# Altium schematic sheet MMC_2_4_Ethernet.SchDoc
size A4
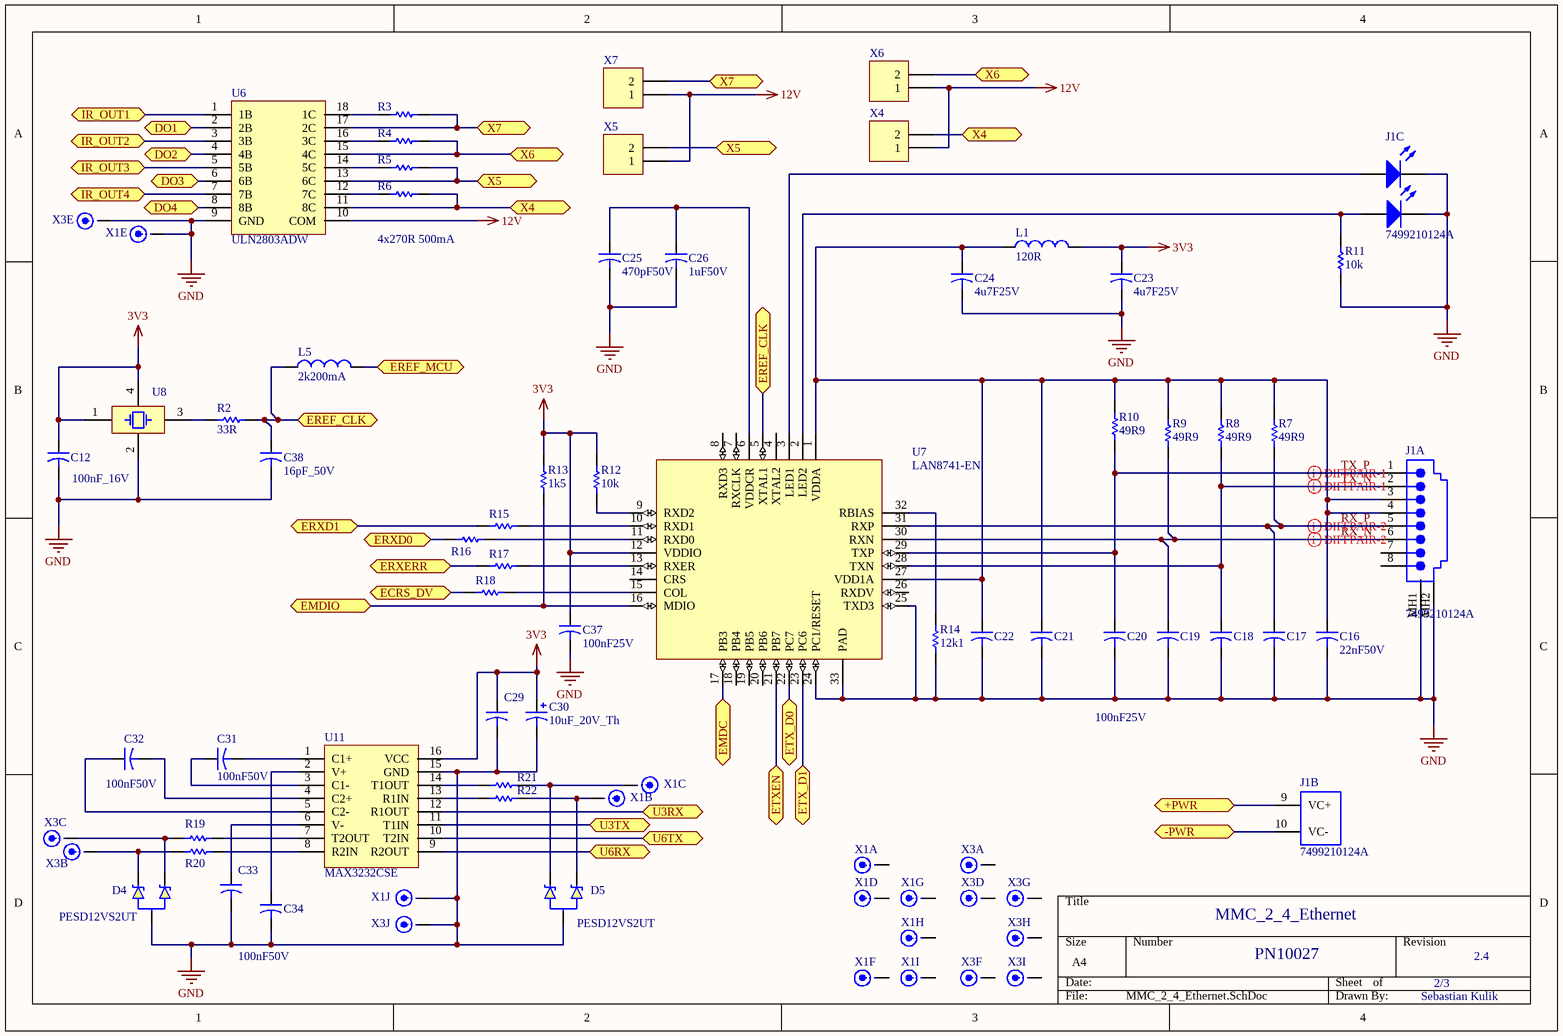
[diagram p0: MMC_2_4_Ethernet.SchDoc]

## Parts
C12  value 100nF_16V  [C0402]  (hidden comment: 100nF16V_0402)
C16  value 22nF50V  [C0603]  (hidden comment: 22nF50V_0603)
C17  10pF50V_0603  [C0603]  (value not drawn)
C18  10pF50V_0603  [C0603]  (value not drawn)
C19  10pF50V_0603  [C0603]  (value not drawn)
C20  10pF50V_0603  [C0603]  (value not drawn)
C21  value 100nF25V  [C0402]  (hidden comment: 100nF25V_0402)
C22  100nF25V_0402  [C0402]  (value not drawn)
C23  value 4u7F25V  [C0805]  (hidden comment: 4u7F25V_0805)
C24  value 4u7F25V  [C0805]  (hidden comment: 4u7F25V_0805)
C25  value 470pF50V  [C0402]  (hidden comment: 470pF50V_0402)
C26  value 1uF50V  [C0603]  (hidden comment: 1uF50V_0603)
C29  100nF25V_0402  [C0402]  (value not drawn)
C30  value 10uF_20V_Th  [Vishay293D-B]  (hidden comment: 10uF_20V_V293D-B)
C31  value 100nF50V  [C0402]  (hidden comment: 100n50V_0402)
C32  value 100nF50V  [C0402]  (hidden comment: 100n50V_0402)
C33  100n50V_0402  [C0402]  (value not drawn)
C34  value 100nF50V  [C0402]  (hidden comment: 100n50V_0402)
C37  value 100nF25V  [C0402]  (hidden comment: 100nF25V_0402)
C38  value 16pF_50V  [C0402]  (hidden comment: 16pF50V_0402)
D4  PESD12VS2UT  [SOT23_N]
D5  PESD12VS2UT  [SOT23_N]
J1  7499210124A  [7499210124A]  (parts A,B,C of 3)
L1  value 120R  [L0603]  (hidden comment: 120R4A_0603)
L5  value 2k200mA  [L0805_M]  (hidden comment: 2k200mA_0805)
R2  value 33R  [R0402]  (hidden comment: 33R_0402)
R3  270R_1210  [R1210_N]  (value not drawn)
R4  270R_1210  [R1210_N]  (value not drawn)
R5  270R_1210  [R1210_N]  (value not drawn)
R6  270R_1210  [R1210_N]  (value not drawn)
R7  value 49R9  [R0402]  (hidden comment: 49R9_0402)
R8  value 49R9  [R0402]  (hidden comment: 49R9_0402)
R9  value 49R9  [R0402]  (hidden comment: 49R9_0402)
R10  value 49R9  [R0402]  (hidden comment: 49R9_0402)
R11  value 10k  [R0402]  (hidden comment: 10k_0402)
R12  value 10k  [R0402]  (hidden comment: 10k_0402)
R13  value 1k5  [R0402]  (hidden comment: 1k5_0402)
R14  value 12k1  [R0603(1608)]  (hidden comment: 12k1_0603)
R15  10R_0402  [R0402]  (value not drawn)
R16  10R_0402  [R0402]  (value not drawn)
R17  10R_0402  [R0402]  (value not drawn)
R18  10R_0402  [R0402]  (value not drawn)
R19  10R_0402  [R0402]  (value not drawn)
R20  10R_0402  [R0402]  (value not drawn)
R21  10R_0402  [R0402]  (value not drawn)
R22  10R_0402  [R0402]  (value not drawn)
U6  ULN2803ADW  [SOIC18-WIDE]
U7  LAN8741-EN  [32M1-A_M]
U8  SG - 211 S*E -50.000M  [SG - 211 S*E]  (value not drawn)
U11  MAX3232CSE  [SOIC16_L]
X1  SUB-D_9  [M09HP]  (value not drawn)  (parts A,B,C,D,E,F,G,H,I,J of 10)
X3  SUB-D_9  [M09HP]  (value not drawn)  (parts A,B,C,D,E,F,G,H,I,J of 10)
X4  WR-TBL3127  [WR-TBL-3127]  (value not drawn)
X5  WR-TBL3127  [WR-TBL-3127]  (value not drawn)
X6  WR-TBL3127  [WR-TBL-3127]  (value not drawn)
X7  WR-TBL3127  [WR-TBL-3127]  (value not drawn)

## Ports
+PWR, -PWR, DO1, DO2, DO3, DO4, ECRS_DV, EMDC, EMDIO, EREF_CLK, EREF_MCU, ERXD0, ERXD1, ERXERR, ETX_D0, ETX_D1, ETXEN, IR_OUT1, IR_OUT2, IR_OUT3, IR_OUT4, U3RX, U3TX, U6RX, U6TX, X4, X5, X6, X7

## Nets
3V3: C12.1 C23.1 C29.1 C30.1 C37.1 L1.2 R12.2 R13.2 U7.12(VDDIO) U8.1(E/D) U8.4(VCC) U11.16(VCC)
12V: U6.10(COM) X4.1 X5.1 X6.1 X7.1
GND: C12.2 C16.2 C17.2 C18.2 C19.2 C20.2 C21.2 C22.2 C23.2 C24.2 C25.2 C26.2 C29.2 C30.2 C33.2 C34.2 C37.2 C38.2 D4.1(A) D5.1(A) J1.11(K) J1.13(K) J1.MH1(Shield) J1.MH2(Shield) R11.1 R14.1 U6.9(GND) U7.24(PC1/RESET) U7.25(TXD3) U7.33(PAD) U8.2(GND) U11.15(GND) X1.5 X1.10(GND) X3.5 X3.10(GND)
+PWR: J1.9(VC+) ; port +PWR
-PWR: J1.10(VC-) ; port -PWR
DO1: U6.2(2B) ; port DO1
DO2: U6.4(4B) ; port DO2
DO3: U6.6(6B) ; port DO3
DO4: U6.8(8B) ; port DO4
ECRS_DV: R18.2 ; port ECRS_DV
EMDC: U7.17(PB3) ; port EMDC
EMDIO: R13.1 U7.16(MDIO) ; port EMDIO
EREF_CLK: C38.1 L5.1 R2.2 U7.5(XTAL1) ; port EREF_CLK
EREF_MCU: L5.2 ; port EREF_MCU
ERXD0: R16.2 ; port ERXD0
ERXD1: R15.2 ; port ERXD1
ERXERR: R17.2 ; port ERXERR
ETX_D0: U7.22(PC7) ; port ETX_D0
ETX_D1: U7.23(PC6) ; port ETX_D1
ETXEN: U7.21(PB7) ; port ETXEN
IR_OUT1: U6.1(1B) ; port IR_OUT1
IR_OUT2: U6.3(3B) ; port IR_OUT2
IR_OUT3: U6.5(5B) ; port IR_OUT3
IR_OUT4: U6.7(7B) ; port IR_OUT4
RX_N: C19.1 J1.6 R9.1 U7.30(RXN)
RX_P: C17.1 J1.5 R7.1 U7.31(RXP)
TX_N: C18.1 J1.2 R8.1 U7.28(TXN)
TX_P: C20.1 J1.1 R10.1 U7.29(TXP)
U3RX: U11.12(R1OUT) ; port U3RX
U3TX: U11.11(T1IN) ; port U3TX
U6RX: U11.9(R2OUT) ; port U6RX
U6TX: U11.10(T2IN) ; port U6TX
X4: R6.2 U6.11(8C) X4.2 ; port X4
X5: R5.2 U6.13(6C) X5.2 ; port X5
X6: R4.2 U6.15(4C) X6.2 ; port X6
X7: R3.2 U6.17(2C) X7.2 ; port X7
NetC16_1: C16.1 C21.1 C22.1 C24.1 J1.3 J1.4 L1.1 R7.2 R8.2 R9.2 R10.2 U7.1(VDDA) U7.27(VDD1A)
NetC25_1: C25.1 C26.1 U7.6(VDDCR)
NetC31_1: C31.1 U11.3(C1-)
NetC31_2: C31.2 U11.1(C1+)
NetC32_1: C32.1 U11.5(C2-)
NetC32_2: C32.2 U11.4(C2+)
NetC33_1: C33.1 U11.6(V-)
NetC34_1: C34.1 U11.2(V+)
NetD4_2: D4.2(K2) R20.1 X3.2
NetD4_3: D4.3(K1) R19.1 X3.3
NetD5_2: D5.2(K2) R21.2 X1.3
NetD5_3: D5.3(K1) R22.2 X1.2
NetJ1_12: J1.12(A) U7.3(LED1)
NetJ1_14: J1.14(A) R11.2 U7.2(LED2)
NetR2_1: R2.1 U8.3(OSC2)
NetR3_1: R3.1 U6.18(1C)
NetR4_1: R4.1 U6.16(3C)
NetR5_1: R5.1 U6.14(5C)
NetR6_1: R6.1 U6.12(7C)
NetR12_1: R12.1 U7.9(RXD2)
NetR14_2: R14.2 U7.32(RBIAS)
NetR15_1: R15.1 U7.10(RXD1)
NetR16_1: R16.1 U7.11(RXD0)
NetR17_1: R17.1 U7.13(RXER)
NetR18_1: R18.1 U7.15(COL)
NetR19_2: R19.2 U11.7(T2OUT)
NetR20_2: R20.2 U11.8(R2IN)
NetR21_1: R21.1 U11.14(T1OUT)
NetR22_1: R22.1 U11.13(R1IN)

Not connected (* = marked no-connect by the designer): J1 7 8; U7 4(XTAL2) 7(RXCLK) 8(RXD3) 14(CRS) 18(PB4) 19(PB5) 20(PB6) 26(RXDV); X1 1 4 6 7 8 9; X3 1 4 6 7 8 9

## Layout directives
differential pair: RX_N, RX_P, TX_N, TX_P

## Notes on the sheet
- 4x270R 500mA
- MMC_2_4_Ethernet
- PN10027
- 2/3
- 2.4
- Sebastian Kulik

## Library data of the parts
C12 = 100nF16V_0402: TDK. CGA series, X7R, 10%, 16V; Deliverer PartNr: 2366533; Manufacturer: TDK; Manufacturer PartNr: CGA2B1X7R1C104K050BC; Deliverer: Farnell; TDE-PN: C0025; Published: 12.02.2014; Part Description: TDK. CGA series, X7R, 10%, 16V; Publisher: Sebastian Kulik; PackageDescription: C0402
C16 = 22nF50V_0603: AVX ,  X7R, 5%, 50V; Deliverer PartNr: 1835412; Manufacturer PartNr: 06035C223JAT2A; Deliverer: Farnell; TDE-PN: C0034; Published: 13.02.2014; Part Description: AVX ,  X7R, 5%, 50V; Publisher: Sebastian Kulik; PackageDescription: C0603; Manufacturer: AVX
C17-C20 = 10pF50V_0603: AVX ,  +-0.5pF, 50V; Deliverer PartNr: 2332595RL; Manufacturer PartNr: 06035A100DAT2A; Deliverer: Farnell; TDE-PN: C0033; Published: 13.02.2014; Part Description: AVX ,  +-0.5pF, 50V; Publisher: Sebastian Kulik; PackageDescription: C0603; Manufacturer: AVX; Value: 10pF50V
C21 C22 C29 C37 = 100nF25V_0402: AVX, X5R, 10%, 25V; Deliverer PartNr: 1833862; Manufacturer PartNr: 04023D104KAT2A; Deliverer: Farnell; TDE-PN: C0036; Published: 09.12.2014; Part Description: AVX, X5R, 10%, 25V; Publisher: Sebastian Kulik; PackageDescription: C0402; Manufacturer: AVX
  C22 C29: Value: 100nF25V
C23 C24 = 4u7F25V_0805: TDK  C series, X7R, 10%, 25V; Deliverer PartNr: 2346943RL; Manufacturer PartNr: C2012X7R1E475K125AB; Deliverer: Farnell; TDE-PN: C0035; Published: 13.02.2014; Part Description: TDK  C series, X7R, 10%, 25V; Publisher: Sebastian Kulik; PackageDescription: C0805; Manufacturer: TDK
C25 = 470pF50V_0402: AVX, 50V; Deliverer PartNr: 1657927; Manufacturer PartNr: 04025A471JAT2A; Deliverer: Farnell; TDE-PN: C0030; Published: 13.02.2014; Part Description: AVX,50V; Publisher: Sebastian Kulik; PackageDescription: C0402; Manufacturer: AVX
C26 = 1uF50V_0603: C series, X5R, 10%; Deliverer PartNr: 2211179RL; Manufacturer: TDK; Manufacturer PartNr: C1608X5R1H105K080AB; Deliverer: Farnell; TDE-PN: C0037; Published: 13.02.2014; Part Description: C series, X5R, 10%; Publisher: Sebastian Kulik; PackageDescription: C0603
C30 = 10uF_20V_V293D-B: 293 series, tantal, 10%, 10V; Part Description: 293 series, tantal, 10%, 20V; Deliverer PartNr: 1754203; Manufacturer: Vishay; Manufacturer PartNr: 293D106X9020B2TE3; Deliverer: Farnell; TDE-PN: C0043; Published: 14.03.2014; Publisher: Sebastian Kulik; PackageDescription: Vishay-293D-B
C31 C32 C34 = 100n50V_0402: C series, X5R, 10%, 50V; Part Description: GRM series, X5R, 10%, 50V; Deliverer PartNr: 2218856; Manufacturer: Murata; Manufacturer PartNr: GRM155R61H104KE19D; Deliverer: Farnell; TDE-PN: C0044; Published: 13.02.2014; Publisher: Sebastian Kulik; PackageDescription: C0402
C33 = 100n50V_0402: C series, X5R, 10%, 50V; Part Description: GRM series, X5R, 10%, 50V; Deliverer PartNr: 2218856; Manufacturer: Murata; Manufacturer PartNr: GRM155R61H104KE19D; Deliverer: Farnell; Value: 100nF50V; TDE-PN: C0044; Published: 13.02.2014; Publisher: Sebastian Kulik; PackageDescription: C0402
C38 = 16pF50V_0402: C series, 5%, 50V; Deliverer PartNr: 1865423; Manufacturer: Kemet; Manufacturer PartNr: C0402C160J5GACTU; Deliverer: Farnell; TDE-PN: C0020; Published: 11.03.2014; Part Description: C series, 5%, 50V; Publisher: Sebastian Kulik; PackageDescription: C0402
D4 D5 = PESD12VS2UT: EDS diode(s); Deliverer PartNr: 8737401; Manufacturer: NXP; TDE-PN: DIS0035; Deliverer: Farnell; Published: 05.12.2014; Publisher: Sebastian Kulik; PackageDescription: SOT23; Manufacturer PartNr: PESD12VS2UT
J1 = Ethernet, POE, WE7499210124A: Modular Jack , Right Angle RJ-45, Low Profile; Manufacturer: Wuerth Elektronik; Ports: 1; PCB_Mounting: Thru-Hole; Deliverer: WE; TDE-PN: CON0013; Publisher: Sebastian Kulik; Deliverer PartNr: 7499210124A; Manufacturer PartNr: 7499210124A; PackageDescription: 7499210124A
L1 = 120R4A_0603: Murata, Ferrit, 120Rx2A; Deliverer PartNr: 1515738RL; Manufacturer PartNr: BLM18PG121SN1D; Deliverer: Farnell; TDE-PN: P0016; Manufacturer: Murata; Published: 13.02.2014; Publisher: Sebastian Kulik; PackageDescription: L0603
L5 = 2k200mA_0805: Ferrit, 2k, 200mA; Deliverer PartNr: 742792092; Deliverer: WE; TDE-PN: P0037; Manufacturer: WE; Manufacturer PartNr: 742792092; Published: 09.03.2015; Publisher: Sebastian Kulik; PackageDescription: L0805_M
R2 = 33R_0402: Vishay CRCW series, 63mW, 1%; Manufacturer PartNr: CRCW040233R0FKEAHP; Deliverer PartNr: 1738830; TDE-PN: R0037; Deliverer: Farnell; Published: 12.02.2014; Publisher: Sebastian Kulik; PackageDescription: 0402; Manufacturer: Vishay; Part Description: Vishay CRCW series, 63mW, 1%
R3-R6 = 270R_1210: ERJ series, 500mW, 5%; Manufacturer: Panasonic; Manufacturer PartNr: ERJ14YJ271U; Deliverer PartNr: 2324044; TDE-PN: R0042; Deliverer: Farnell; Value: 270R; Published: 13.03.2014; Publisher: Sebastian Kulik; PackageDescription: 1210; Part Description: ERJ series, 500mW, 5%
R7-R10 = 49R9_0402: Vishay CRCW series, 63mW, 1%; Manufacturer PartNr: CRCW040249R9FKED; Deliverer PartNr: 2121437; TDE-PN: R0035; Deliverer: Farnell; Published: 13.02.2014; Publisher: Sebastian Kulik; PackageDescription: 0402; Manufacturer: Vishay; Part Description: Vishay CRCW series, 63mW, 1%
R11 R12 = 10k_0402: Vishay CRCW series, 125mW, 1%; Manufacturer PartNr: CRCW040210K0FKEAHP; Deliverer PartNr: 1738864; TDE-PN: R0012; Deliverer: Farnell; Published: 12.02.2014; Publisher: Sebastian Kulik; PackageDescription: 0402; Manufacturer: Vishay; Part Description: Vishay CRCW series, 125mW, 1%
R13 = 1k5_0402: Vishay CRCW series, 125mW, 1%; Manufacturer PartNr: CRCW04021K50FKEAHP; Deliverer PartNr: 1738852; Part Description: Vishay CRCW series, 63mW, 1%; TDE-PN: R0036; Deliverer: Farnell; Published: 13.02.2014; Publisher: Sebastian Kulik; PackageDescription: 0402; Manufacturer: Vishay
R14 = 12k1_0603: Vishay, CRCW series, 100mW, 1%; Manufacturer PartNr: CRCW060312K1FKEA; Deliverer PartNr: 2122502; TDE-PN: R0037; Deliverer: Farnell; Published: 11.02.2014; Publisher: Sebastian Kulik; PackageDescription: 0603; Manufacturer: Vishay; Part Desicription: Vishay, CRCW series, 100mW, 1%
R15-R22 = 10R_0402: Vishay CRCW series, 125mW, 1%; Manufacturer PartNr: CRCW040210R0FKEAHP; Deliverer PartNr: 1738824RL; TDE-PN: R0015; Deliverer: Farnell; Value: 10R; Published: 12.02.2014; Publisher: Sebastian Kulik; PackageDescription: 0402; Manufacturer: Vishay; Part Description: Vishay CRCW series, 125mW, 1%
U6 = ULN2803ADW: Darlington array, 50V; Deliverer PartNr: 1652419; Manufacturer: TI; Deliverer: Farnell; TDE-PN: IC0043; Published: 13.03.2014; Publisher: Sebastian Kulik; Manufacturer PartNr: ULN2803ADW; PackageDescription: SOIC18-WIDE
U7 = LAN8741-EN: Ethernet Phy; Deliverer PartNr: 2373284; Manufacturer: Microchip; TDE-PN: IC0036; Deliverer: Farnell; Published: 12.02.2014; LatestRevisionNote: IPC-7351 Footprint Added.; Publisher: Sebastian Kulik; Manufacturer PartNr: LAN8741-EN; PackageDescription: 32M1-A-L/M/N
U8 = SG - 211 S*E -50.000M: Crystal; Deliverer PartNr: 2405766RL; Manufacturer PartNr: X1G0036210074; Manufacturer: Epson; Deliverer: Farnell; TDE-PN: IC0050; Published: 26.05.2014; Publisher: Sebastian Kulik; PackageDescription: SG-221 S*E
U11 = MAX3232CSE: RS232 transceiver; Deliverer PartNr: 9725490; Manufacturer PartNr: MAX3232CSE+; Manufacturer: Maxim; Deliverer: Farnell; TDE-PN: IC0044; Published: 14.03.2014; Publisher: Sebastian Kulik; PackageDescription: SOIC16_L
X1 X3 = SUB-D_9: Deliverer PartNr: 1-1634580-2; Manufacturer: AMP; Deliverer: Arrow; TDE-PN: CON0007; LatestRevisionDate: 14.03.2014; LatestRevisionNote: Re-released for DXP Platform.; Publisher: Sebastian Kulik; Manufacturer PartNr: 1-1634580-2; PackageDescription: M09HP
X4-X7 = Header-2-WR-TBL3127: Header 2 pin, horizontal,WR-TBL3127; Deliverer PartNr: 1841288; Manufacturer: WE; Manufacturer PartNr: 691312710002; Deliverer: Farnell; TDE-PN: CON0014; LatestRevisionDate: 28.05.2014; LatestRevisionNote: Re-released for DXP Platform.; Publisher: Sebastian Kulik; PackageDescription: WR-TBL-3127